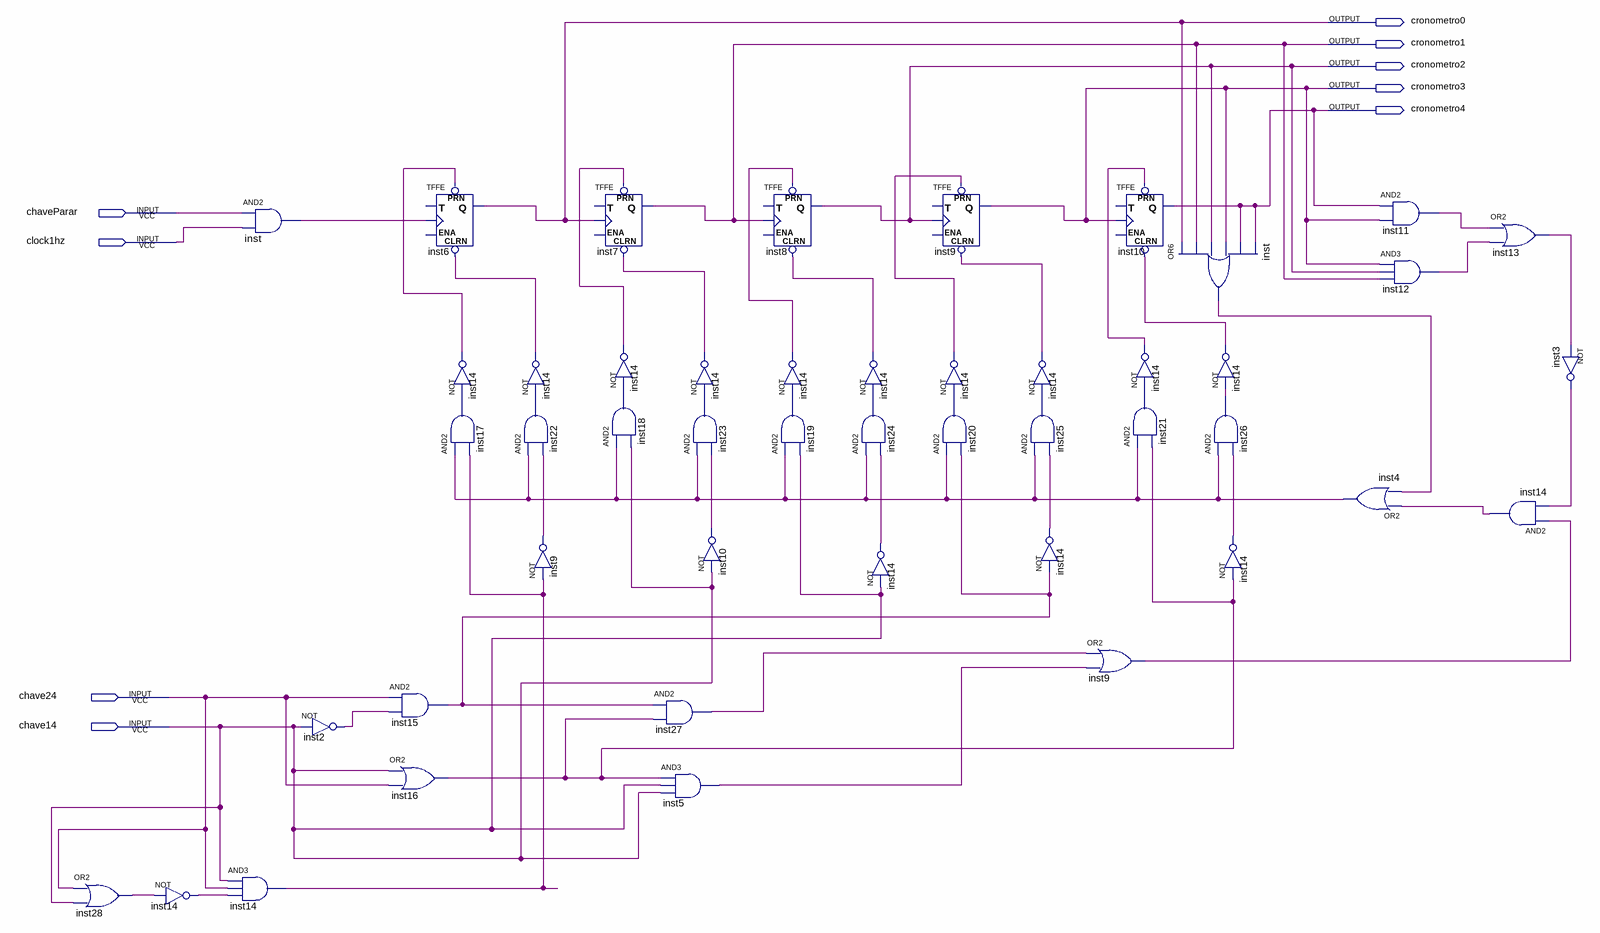
[diagram p0: schematic sheet]
// Quartus schematic cronometroRegressivoEsquematico.bdf as structural Verilog: 47 symbols, 9 pins
module cronometroRegressivoEsquematico (
  input  chaveParar,
  input  clock1hz,
  input  chave24,
  input  chave14,
  output cronometro0,
  output cronometro1,
  output cronometro2,
  output cronometro3,
  output cronometro4
);

  wire inst2_out, inst3_out, inst4_out, inst5_out, inst9_out, inst9_out_2, inst10_out, inst11_out,
       inst12_out, inst13_out, inst14_out, inst14_out_2, inst14_out_3, inst14_out_4, inst14_out_5,
       inst14_out_6, inst14_out_7, inst14_out_8, inst14_out_9, inst14_out_10, inst14_out_11, inst14_out_12,
       inst14_out_13, inst14_out_14, inst14_out_15, inst14_out_16, inst15_out, inst16_out, inst17_out,
       inst18_out, inst19_out, inst20_out, inst21_out, inst22_out, inst23_out, inst24_out, inst25_out,
       inst26_out, inst27_out, inst28_out, inst_out, inst_out_2;

  or inst28 (inst28_out, chave24, chave14);
  not inst14 (inst14_out_4, inst28_out);
  and inst (inst_out, chaveParar, clock1hz);
  and inst14_dup2 (inst14_out_6, chave14, chave24, inst14_out_4);
  not inst2 (inst2_out, chave14);
  TFFE inst6 (.CLRN(inst14_out_7), .CLK(inst_out), .PRN(inst14_out_8), .Q(cronometro0));  // open: T, ENA
  and inst15 (inst15_out, chave24, inst2_out);
  or inst16 (inst16_out, chave14, chave24);
  not inst14_dup3 (inst14_out_8, inst17_out);
  and inst17 (inst17_out, inst4_out, inst14_out_6);
  not inst14_dup4 (inst14_out_7, inst22_out);
  and inst22 (inst22_out, inst4_out, inst9_out_2);
  not inst9 (inst9_out_2, inst14_out_6);
  TFFE inst7 (.CLRN(inst14_out_10), .CLK(cronometro0), .PRN(inst14_out_9), .Q(cronometro1));  // open: T, ENA
  not inst14_dup5 (inst14_out_9, inst18_out);
  and inst18 (inst18_out, inst4_out, chave14);
  and inst27 (inst27_out, inst15_out, inst16_out);
  and inst5 (inst5_out, inst16_out, chave14, chave14);
  not inst14_dup6 (inst14_out_10, inst23_out);
  and inst23 (inst23_out, inst4_out, inst10_out);
  not inst10 (inst10_out, chave14);
  TFFE inst8 (.CLRN(inst14_out_12), .CLK(cronometro1), .PRN(inst14_out_11), .Q(cronometro2));  // open: T, ENA
  not inst14_dup7 (inst14_out_11, inst19_out);
  and inst19 (inst19_out, inst4_out, chave14);
  not inst14_dup8 (inst14_out_12, inst24_out);
  and inst24 (inst24_out, inst4_out, inst14_out_2);
  not inst14_dup9 (inst14_out_2, chave14);
  TFFE inst9_dup2 (.CLRN(inst14_out_14), .CLK(cronometro2), .PRN(inst14_out_13), .Q(cronometro3));  // open: T, ENA
  not inst14_dup10 (inst14_out_13, inst20_out);
  and inst20 (inst20_out, inst4_out, inst15_out);
  and inst25 (inst25_out, inst4_out, inst14_out_5);
  not inst14_dup11 (inst14_out_14, inst25_out);
  not inst14_dup12 (inst14_out_5, inst15_out);
  TFFE inst10_dup2 (.CLRN(inst14_out_16), .CLK(cronometro3), .PRN(inst14_out_15), .Q(cronometro4));  // open: T, ENA
  not inst14_dup13 (inst14_out_15, inst21_out);
  and inst21 (inst21_out, inst4_out, inst16_out);
  or inst9_dup3 (inst9_out, inst27_out, inst5_out);
  or inst_dup2 (inst_out_2, cronometro0, cronometro1, cronometro2, cronometro3, cronometro4, cronometro4);
  not inst14_dup14 (inst14_out_16, inst26_out);
  and inst26 (inst26_out, inst4_out, inst14_out_3);
  not inst14_dup15 (inst14_out_3, inst16_out);
  or inst4 (inst4_out, inst14_out, inst_out_2);
  and inst11 (inst11_out, cronometro4, cronometro3);
  and inst12 (inst12_out, cronometro3, cronometro2, cronometro1);
  or inst13 (inst13_out, inst11_out, inst12_out);
  and inst14_dup16 (inst14_out, inst9_out, inst3_out);
  not inst3 (inst3_out, inst13_out);
endmodule
